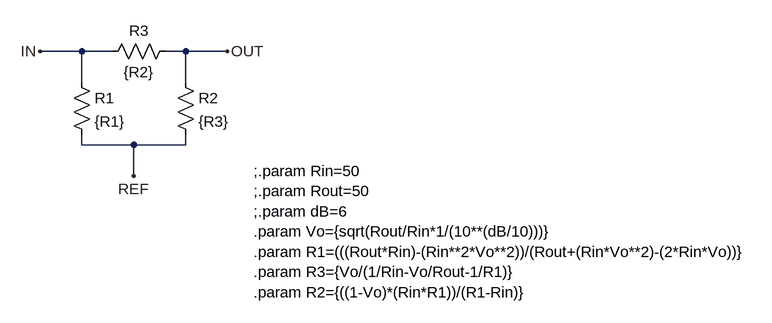
[diagram p0: schematic atten.asc]
atten.asc, the LTspice schematic file:
Version 4
SHEET 1 1792 680
WIRE 48 80 -16 80
WIRE 96 80 48 80
WIRE 208 80 176 80
WIRE 272 80 208 80
WIRE 48 128 48 80
WIRE 208 128 208 80
WIRE 48 224 48 208
WIRE 128 224 48 224
WIRE 208 224 208 208
WIRE 208 224 128 224
WIRE 128 272 128 224
FLAG -16 80 IN
FLAG 272 80 OUT
FLAG 128 272 REF
SYMBOL res 32 112 R0
SYMATTR InstName R1
SYMATTR Value {R1}
SYMBOL res 192 112 R0
SYMATTR InstName R2
SYMATTR Value {R3}
SYMBOL res 192 64 R90
WINDOW 0 0 56 VBottom 2
WINDOW 3 32 56 VTop 2
SYMATTR InstName R3
SYMATTR Value {R2}
TEXT 312 264 Left 2 !;.param Rin=50\n;.param Rout=50\n;.param dB=6\n.param Vo={sqrt(Rout/Rin*1/(10**(dB/10)))}\n.param R1=(((Rout*Rin)-(Rin**2*Vo**2))/(Rout+(Rin*Vo**2)-(2*Rin*Vo))}\n.param R3={Vo/(1/Rin-Vo/Rout-1/R1)}\n.param R2={((1-Vo)*(Rin*R1))/(R1-Rin)}

The netlist it stands for:
* atten.asc
R1 IN REF {R1}
R2 OUT REF {R3}
R3 OUT IN {R2}
;.param Rin=50
;.param Rout=50
;.param dB=6
.param Vo={sqrt(Rout/Rin*1/(10**(dB/10)))}
.param R1=(((Rout*Rin)-(Rin**2*Vo**2))/(Rout+(Rin*Vo**2)-(2*Rin*Vo))}
.param R3={Vo/(1/Rin-Vo/Rout-1/R1)}
.param R2={((1-Vo)*(Rin*R1))/(R1-Rin)}
.backanno
.end